# EAGLE schematic Inventor (EAGLE 9.6.2)
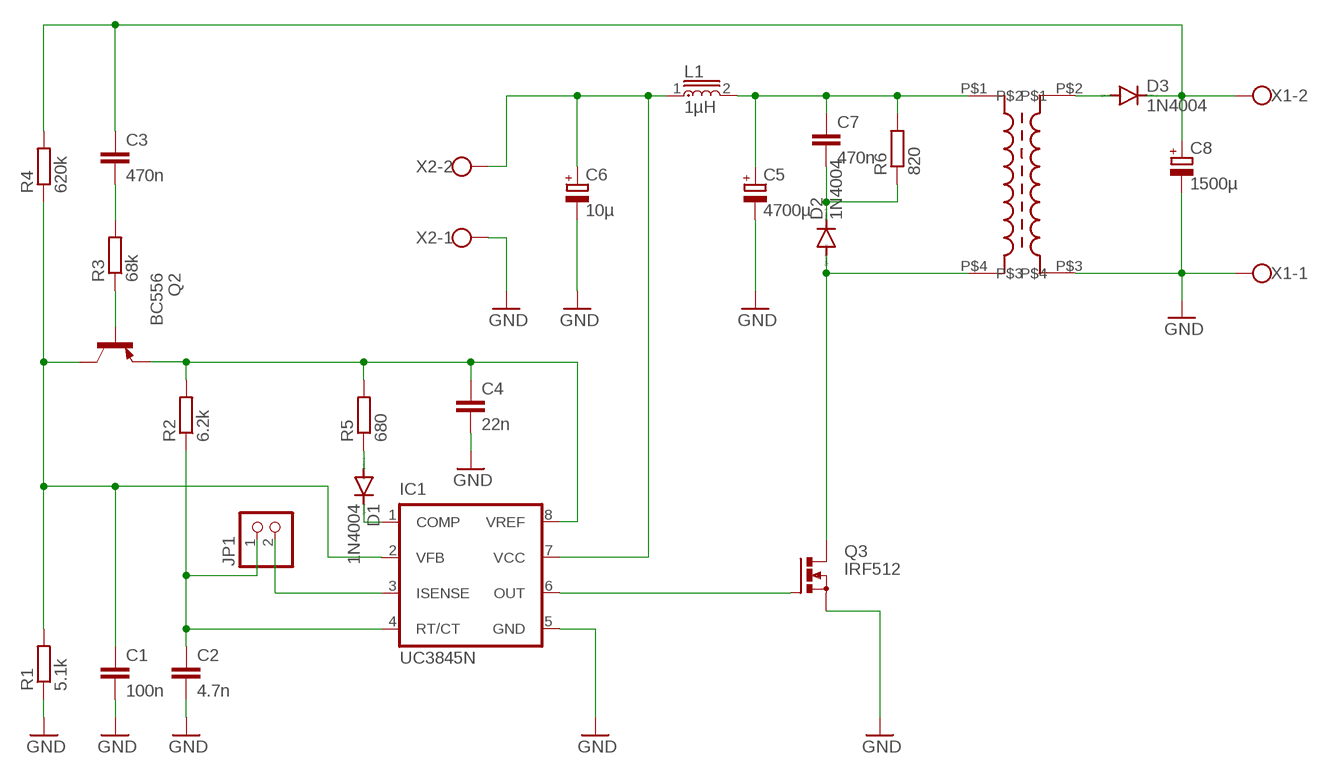
[diagram p0: schematic, sheet 1]

## Parts
C1  100n  C-EU025-025X050  [C025-025X050]
C2  4.7n  C-EU025-025X050  [C025-025X050]
C3  470n  C-EU025-025X050  [C025-025X050]
C4  22n  C-EU025-025X050  [C025-025X050]
C5  4700µ  CPOL-EUE2.5-6  [E2,5-6]
C6  10µ  CPOL-EUE2.5-6  [E2,5-6]
C7  470n  C-EU025-025X050  [C025-025X050]
C8  1500µ  CPOL-EUE2.5-6  [E2,5-6]
D1  1N4004  [DO41-10]
D2  1N4004  [DO41-10]
D3  1N4004  [DO41-10]
IC1  UC3845N  [DIL08]
JP1  PINHD-1X2  [1X02]
L1  1µH  P0762.103NL  [P0762NL]
Q2  BC556  [TO92-EBC]
Q3  IRF512  [TO220BV]
R1  5.1k  R-EU_0204/7  [0204/7]
R2  6.2k  R-EU_0204/7  [0204/7]
R3  68k  R-EU_0204/7  [0204/7]
R4  620k  R-EU_0204/7  [0204/7]
R5  680  R-EU_0204/7  [0204/7]
R6  820  R-EU_0204/7  [0204/7]
U$1  T2  [F2]
X1  W237-102  [W237-102]
X2  W237-102  [W237-102]

## Nets
GND: C1.2 C2.2 C4.2 C5.- C6.- C8.- IC1.5(GND) Q3.S R1.1 U$1.P$3 X1.1 X2.1
N$1: IC1.6(OUT) Q3.G
N$2: IC1.3(ISENSE) JP1.2
N$3: C1.1 IC1.2(VFB) Q2.C R1.2 R4.1
N$4: C2.1 IC1.4(RT/CT) JP1.1 R2.1
N$6: C4.1 IC1.8(VREF) Q2.E R2.2 R5.2
N$7: Q2.B R3.1
N$8: C3.2 R3.2
N$9: C3.1 C8.+ D3.C R4.2 X1.2
N$10: D1.A R5.1
N$11: D1.C IC1.1(COMP)
N$13: C6.+ IC1.7(VCC) L1.1 X2.2
N$14: C5.+ C7.1 L1.2 R6.2 U$1.P$1
N$15: D2.A Q3.D U$1.P$4
N$16: C7.2 D2.C R6.1
N$17: D3.A U$1.P$2

## Library data of the parts
C1-C4 C7 = rcl:C-EU: CAPACITOR, European symbol; SPICEPREFIX: C
C5 C6 C8 = rcl:CPOL-EU: POLARIZED CAPACITOR, European symbol; SPICEPREFIX: C
D1-D3 = diode:1N4004: DIODE general purpose rectifier, 1 A
IC1 = v-reg:UC384*: SMPS Controller Source: http://www.fairchildsemi.com/ds/UC/UC3843.pdf
JP1 = pinhead:PINHD-1X2: PIN HEADER
L1 = inductors:P0762.*NL: Unshielded Drum Core P0762NL Series Source> http://ww2.pulseeng.com/products/datasheets/SPM2007.pdf; SPICEPREFIX: L
Q2 = transistor-pnp:BC556*: PNP Transistror
Q3 = transistor-power:IRF512: N-CHANNEL MOS FET
R1-R6 = rcl:R-EU_: RESISTOR, European symbol; SPICEPREFIX: R
U$1 = transf1:T2
X1 X2 = con-wago-500:W237-102: WAGO SCREW CLAMP; MPN: 237-102; OC_FARNELL: unknown; OC_NEWARK: 70K9898